# EAGLE design NanoBase_L293D (EAGLE 7.6.0)
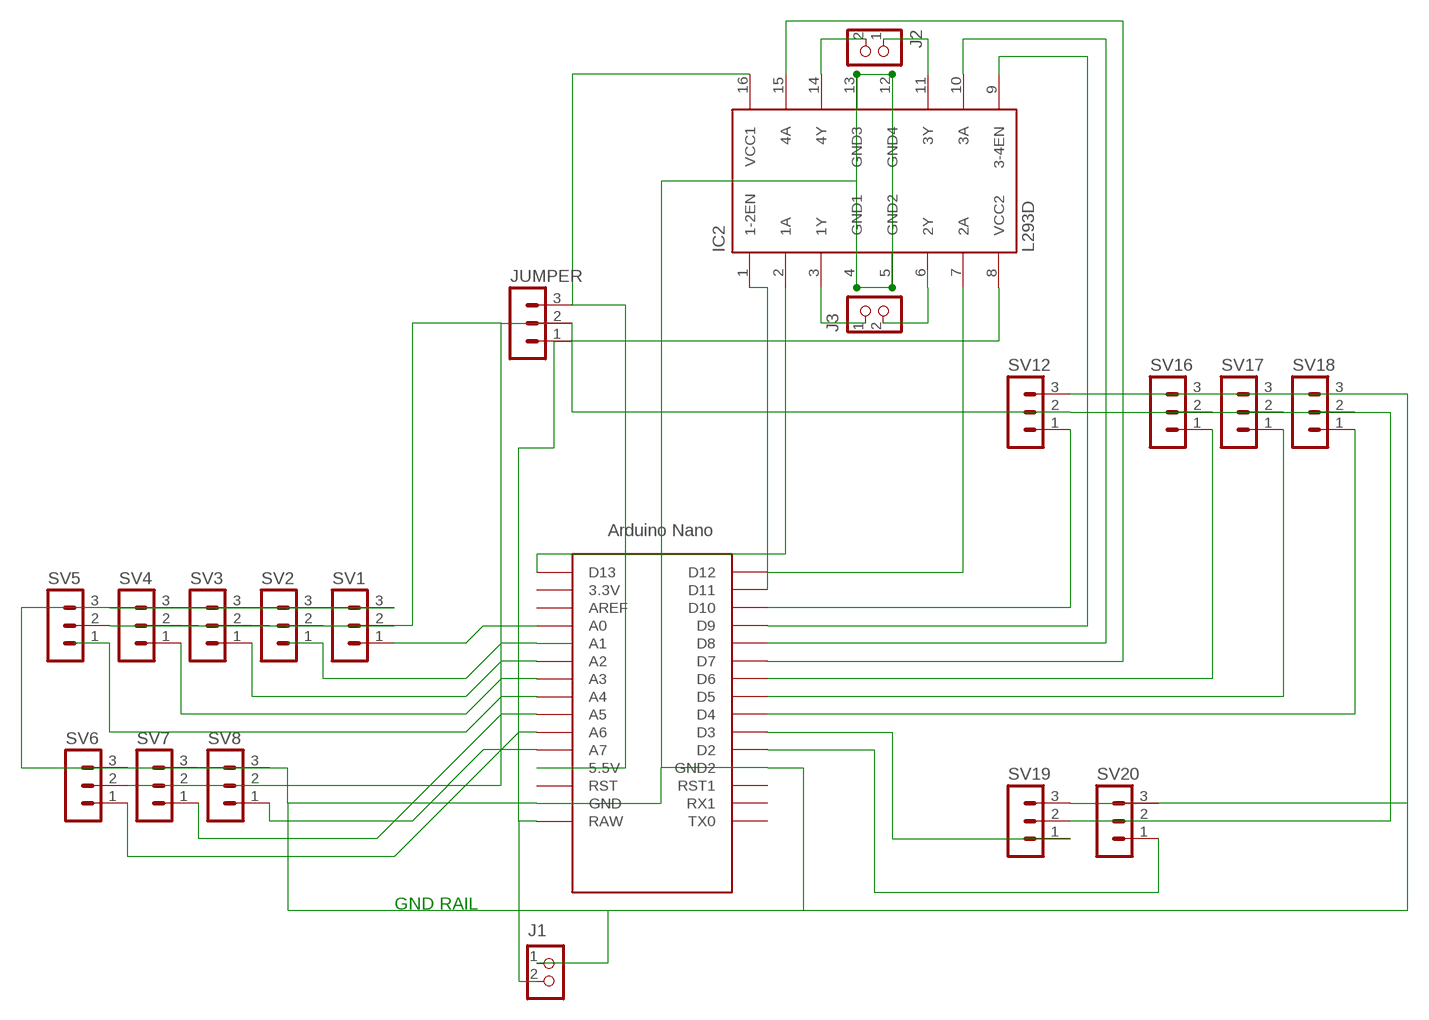
[diagram p0: schematic, sheet 1]

## Parts
IC2  L293D  [DIL16]
J1  CON_TERMINAL_BLOCK_02-5MM  [TERMINAL_BLOCK_2P_5]
J2  CON_TERMINAL_BLOCK_02-5MM  [TERMINAL_BLOCK_2P_5]
J3  CON_TERMINAL_BLOCK_02-5MM  [TERMINAL_BLOCK_2P_5]
JUMPER  MA03-1  [MA03-1]
SV1  MA03-1  [MA03-1]
SV2  MA03-1  [MA03-1]
SV3  MA03-1  [MA03-1]
SV4  MA03-1  [MA03-1]
SV5  MA03-1  [MA03-1]
SV6  MA03-1  [MA03-1]
SV7  MA03-1  [MA03-1]
SV8  MA03-1  [MA03-1]
SV12  MA03-1  [MA03-1]
SV16  MA03-1  [MA03-1]
SV17  MA03-1  [MA03-1]
SV18  MA03-1  [MA03-1]
SV19  MA03-1  [MA03-1]
SV20  MA03-1  [MA03-1]
U$1  NANO  [NANO]

## Nets
5V: IC2.16(VCC1) JUMPER.3 U$1.5V(5.5V)
A4: SV5.1 U$1.A4
A5: SV7.1 U$1.A5
D2: SV20.1 U$1.D2
D3: SV19.1 U$1.D3
D4: SV18.1 U$1.D4
D5: SV17.1 U$1.D5
D6: SV16.1 U$1.D6
D7-4A: IC2.15(4A) U$1.D7
D8-3A: IC2.10(3A) U$1.D8
D9-3-4EN: IC2.9(3-4EN) U$1.D9
D10: SV12.1 U$1.D10
D11-1-2EN: IC2.1(1-2EN) U$1.D11
D12-2A: IC2.7(2A) U$1.D12
D13-1A: IC2.2(1A) U$1.D13
GND: IC2.4(GND1) IC2.5(GND2) IC2.12(GND4) IC2.13(GND3) J1.1 SV1.3 SV2.3 SV3.3 SV4.3 SV5.3 SV6.3 SV7.3 SV8.3 SV12.3 SV16.3 SV17.3 SV18.3 SV19.3 SV20.3 U$1.GND U$1.GND1(GND2)
MIDDLERAIL: JUMPER.2 SV1.2 SV2.2 SV3.2 SV4.2 SV5.2 SV6.2 SV7.2 SV8.2
N$1: SV1.1 U$1.A0
N$4: SV3.1 U$1.A2
N$5: SV4.1 U$1.A3
N$8: SV12.2 SV16.2 SV17.2 SV18.2 SV19.2 SV20.2
N$9: SV6.1 U$1.A6
N$10: SV8.1 U$1.A7
N$11: IC2.14(4Y) J2.2
N$12: IC2.11(3Y) J2.1
N$13: IC2.3(1Y) J3.1
N$14: IC2.6(2Y) J3.2
N$17: SV2.1 U$1.A1
VIN: IC2.8(VCC2) J1.2 JUMPER.1 U$1.RAW
Unconnected: U$1.3.3V U$1.AREF U$1.ICSP1 U$1.ICSP2 U$1.ICSP3 U$1.ICSP4 U$1.ICSP5 U$1.ICSP6 U$1.RST U$1.RST1 U$1.RX1 U$1.TX0

## Notes on the sheet
- GND RAIL

## Library data of the parts
IC2 = st-microelectronics:L293D: PUSH-PULL 4 CHANNEL DRIVER; MPN: L293D; OC_FARNELL: 9589619; OC_NEWARK: 56P8249
J1-J3 = dp_devices:CON_TERMINAL_BLOCK_02: 2 poles wire to board terminal block
JUMPER SV1-SV8 SV12 SV16-SV20 = con-lstb:MA03-1: PIN HEADER; OC_FARNELL: unknown; OC_NEWARK: unknown
U$1 = Arduino-clone:NANO: Arduino Nano

## Board
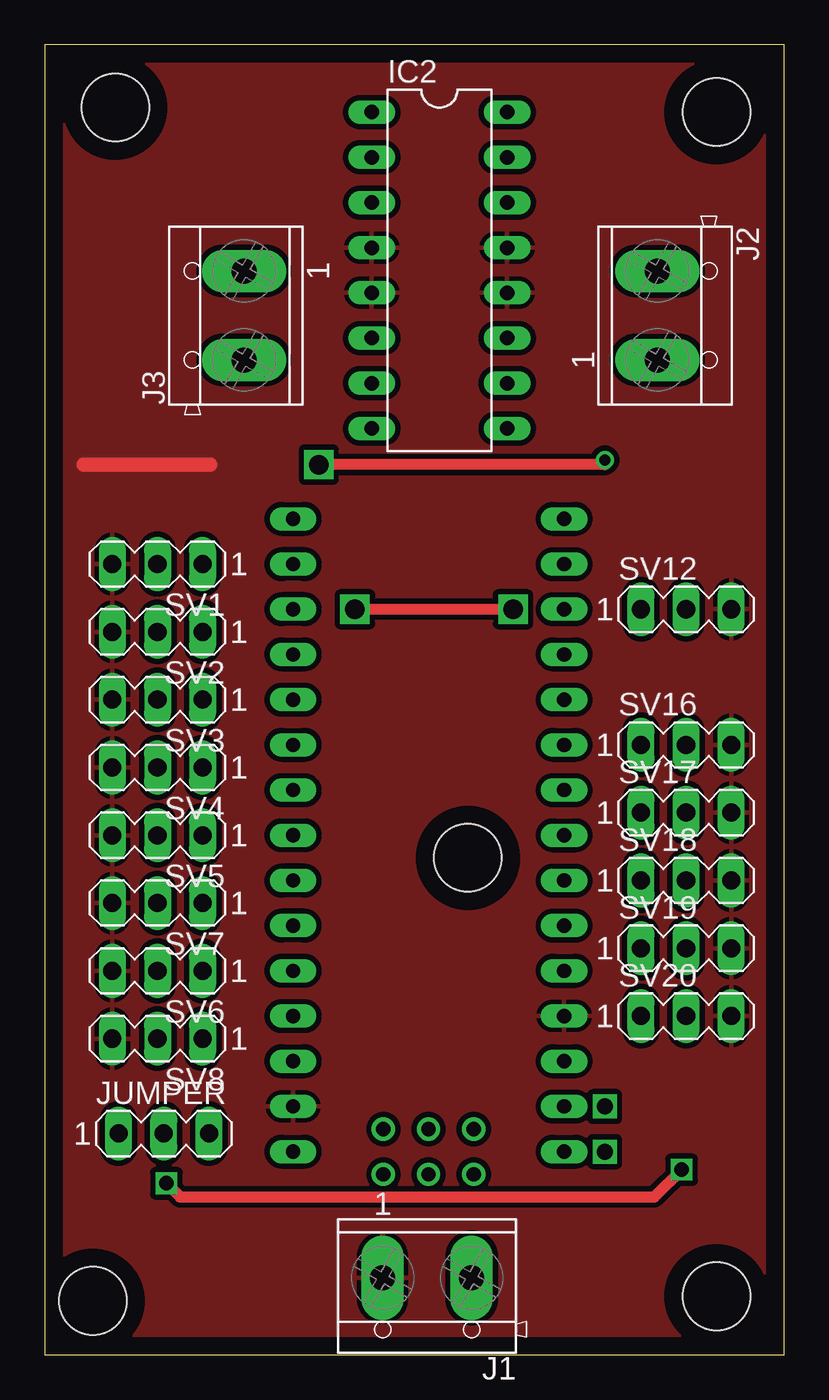
[diagram p1: board, top side]
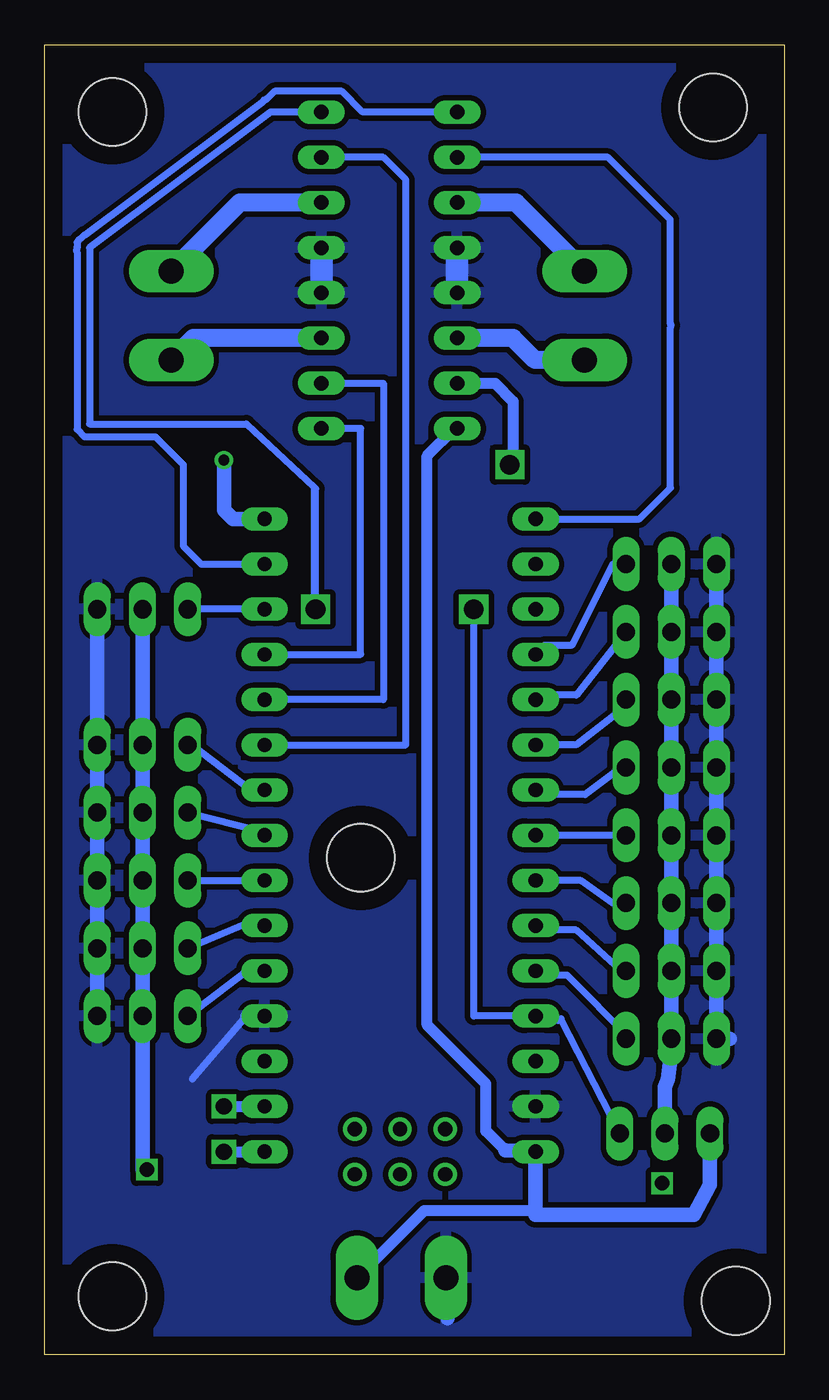
[diagram p2: board, bottom side, seen from below]

Size 41.58 x 73.65 mm. Coordinates in mm from the lower left corner, seen from the top.
Outline: 0,0 41.58,0 41.58,73.65 0,73.65 0,0
Copper layers (1*16): Top 0.035mm / dielectric 1.5mm / Bottom 0.035mm
Design rules "default *": minimum track width 10mil, minimum drill 24mil, track to track 12mil, track to pad 12mil, pad to pad 12mil, via to via 12mil, smd to smd 12mil, copper to edge 40mil, drill to drill 8mil, minimum pad ring 10mil, minimum via ring 8mil, stop-mask expansion 4mil, vias tented up to drill 0mil, thermal gap 10mil
Holes 3.81 mm at 2.72,3.05 3.99,70.1 37.77,69.85 37.77,3.3 23.8,27.94

### Footprints (pad centres in the part's own frame; a part is rotated, then mirrored left to right if it is on the bottom)
DIL16 = drill 0.813 long: 1 -8.89,-3.81; 2 -6.35,-3.81; 3 -3.81,-3.81; 4 -1.27,-3.81; 5 1.27,-3.81; 6 3.81,-3.81; 7 6.35,-3.81; 8 8.89,-3.81; 9 8.89,3.81; 10 6.35,3.81; 11 3.81,3.81; 12 1.27,3.81; 13 -1.27,3.81; 14 -3.81,3.81; 15 -6.35,3.81; 16 -8.89,3.81
TERMINAL_BLOCK_2P_5 = drill 1.4 pad 2.38 long: 1 2.5,-0.45; 2 -2.5,-0.45
MA03-1 = drill 1.016 long: 1 -2.54,0; 2 0,0; 3 2.54,0
NANO = drill 0.8 long: 3.3V -10.16,24.13; 5V -10.16,-1.27; A0 -10.16,19.05; A1 -10.16,16.51; A2 -10.16,13.97; A3 -10.16,11.43; A4 -10.16,8.89; A5 -10.16,6.35; A6 -10.16,3.81; A7 -10.16,1.27; AREF -10.16,21.59; D2 5.08,1.27; D3 5.08,3.81; D4 5.08,6.35; D5 5.08,8.89; D6 5.08,11.43; D7 5.08,13.97; D8 5.08,16.51; D9 5.08,19.05; D10 5.08,21.59; D11 5.08,24.13; D12 5.08,26.67; D13 -10.16,26.67; GND -10.16,-6.35; GND1 5.08,-1.27; RAW -10.16,-8.89; RST -10.16,-3.81; RST1 5.08,-3.81; RX1 5.08,-6.35; TX0 5.08,-8.89 | drill 0.8: ICSP1 -5.08,-10.16; ICSP2 -5.08,-7.62; ICSP3 -2.54,-10.16; ICSP4 -2.54,-7.62; ICSP5 0,-10.16; ICSP6 0,-7.62

### Placement (x,y rotation side)
IC2  22.2,60.96 270 top
J1  21.51,3.89 180 top
J2  34.9,58.42 270 top
J3  10.77,58.42 90 top
JUMPER  6.71,12.45 0 top
SV1  6.35,44.45 180 top
SV2  6.35,40.64 180 top
SV3  6.35,36.83 180 top
SV4  6.35,33.02 180 top
SV5  6.35,29.21 180 top
SV6  6.35,21.59 180 top
SV7  6.35,25.4 180 top
SV8  6.35,17.78 180 top
SV12  36.07,41.91 0 top
SV16  36.07,34.29 0 top
SV17  36.07,30.48 0 top
SV18  36.07,26.67 0 top
SV19  36.07,22.86 0 top
SV20  36.07,19.05 0 top
U$1  24.13,20.32 0 top

### Tracks (layer width: path | path; a pad name or v marks a point on that pad's centre or on a via)
5V  (via drill 1.1)
  Top 0.61: v17.45,41.91 v26.34,41.91
  Bottom 0.406: IC2.16 28.88,69.85 39.04,62.23 39.04,52.32 30.23,52.32 26.42,48.77 | v17.45,41.91 17.45,19.05 U$1.5V 13.72,18.8 12.7,18.8 12.55,18.9 JUMPER.3 | v26.34,41.91 26.34,48.69 26.42,48.77 | 26.42,48.77 26.42,42.16 26.16,41.91 26.42,41.91
A4
  Bottom 0.406: SV5.1 U$1.A4
A5
  Bottom 0.406: SV7.1 9.65,25.4 11.43,26.67 U$1.A5
D2
  Bottom 0.406: SV20.1 30.23,21.59 U$1.D2
D3
  Bottom 0.406: SV19.1 30.48,24.13 29.46,23.88 U$1.D3
  Bottom 0.813: 28.88,24.13 U$1.D3
D4
  Bottom 0.406: SV18.1 U$1.D4
D5
  Bottom 0.406: 33.02,30.48 SV17.1 29.46,29.46 U$1.D5
D6
  Bottom 0.406: SV16.1 33.27,34.29 29.97,31.75 29.46,32 U$1.D6
D7-4A
  Bottom 0.406: U$1.D7 21.26,34.29 21.26,66.04 22.53,67.31 IC2.15
D8-3A
  Bottom 0.406: IC2.10 22.53,54.61 22.53,36.83 U$1.D8
D9-3-4EN
  Bottom 0.406: U$1.D9 23.8,39.37 23.8,52.07 IC2.9 26.34,52.07
D10
  Bottom 0.406: U$1.D10 SV12.1
D11-1-2EN
  Bottom 0.406: 18.72,69.85 IC2.1 23.7,69.85 24.86,71.02 28.65,71.02 29.07,70.6 29.12,70.56 29.17,70.56 29.35,70.39 36.39,65.11 39.28,62.94 39.33,62.94 39.51,62.77 39.7,62.62 39.71,62.57 39.75,62.52 39.75,62.28 39.79,62.04 39.75,61.99 39.75,52.03 39.33,51.61 35.36,51.61 33.78,50.04 33.78,45.47 32.77,44.45 U$1.D11
D12-2A  (via drill 0.61, 1.1)
  Top 0.61: v31.5,50.29 31.5,50.04 v15.42,50.04
  Bottom 0.406: U$1.D12 28.88,46.99
  Bottom 0.61: IC2.7 16.26,54.61 15.24,53.59 15.24,50.22 v15.42,50.04
  Bottom 0.813: v31.5,50.29 31.5,47.5 30.99,46.99 U$1.D12
D13-1A
  Bottom 0.406: 13.45,46.99 U$1.D13 8.13,46.99 6.39,48.73 6.39,57.76 6.34,57.86 6.4,58.03 6.4,63.8 9.91,67.31 IC2.2
GND
  Top 0.813: 9.32,50.04 2.21,50.04
  Bottom 0.406: IC2.5 18.29,59.69 | 30.15,19.05 30.23,19.05 33.27,15.49
  Bottom 0.813: SV12.3 SV16.3 SV17.3 SV18.3 SV19.3 SV20.3 | 30.15,19.05 U$1.GND1 | SV1.3 SV2.3 SV3.3 SV4.3 SV5.3 SV7.3 SV6.3 SV8.3 3.05,17.78 | J1.1 18.99,3.81 | 18.99,3.81 18.93,2.07 | 18.29,5.08 18.48,4.57 18.99,3.81
  Bottom 1.27: IC2.12 IC2.13 | IC2.5 IC2.4
  pour Top: -3.3,74.42 43.69,74.42 43.69,-2.03 -3.3,-2.03
  pour Bottom: -4.83,78.23 43.94,78.23 45.97,76.2 45.97,-1.27 43.43,-3.81 -3.81,-3.81 -5.33,-2.29 -5.33,77.72
MIDDLERAIL
  Bottom 0.813: SV1.2 SV2.2 SV3.2 SV4.2 SV5.2 SV7.2 SV6.2 SV8.2 6.27,17.45 6.53,15.49 6.71,15.06 JUMPER.2
N$1
  Bottom 0.406: 8.56,44.45 9.65,44.45 11.94,39.88 13.46,39.88 U$1.A0
  Bottom 0.813: SV1.1 8.56,44.45
N$2  (via drill 0.9)
  other vias: 31.5,13.97
N$4
  Bottom 0.406: SV3.1 8.38,36.83 11.68,34.29 U$1.A2
N$5
  Bottom 0.406: SV4.1 9.14,33.02 11.18,31.5 13.72,31.5 U$1.A3
N$6  (via drill 0.9)
  other vias: 31.5,11.43
N$7
  Bottom 0.61: 30.99,13.97 30.23,13.97
N$8
  Bottom 0.813: SV12.2 SV16.2 SV17.2 SV18.2 SV19.2 SV20.2
N$9
  Bottom 0.406: SV6.1 9.14,21.59 11.68,23.88 13.72,23.88 U$1.A6
N$10
  Bottom 0.406: SV8.1 8.64,17.78 12.19,21.34 13.72,21.34 U$1.A7
N$11
  Bottom 1.016: IC2.14 30.6,64.77 J2.2
N$12
  Bottom 1.016: IC2.11 33.22,57.15 J2.1
N$13
  Bottom 0.406: 11.1,61.04 J3.1
  Bottom 1.016: J3.1 15.07,64.77 IC2.3
N$14
  Bottom 1.016: J3.2 14.01,55.92 15.24,57.15 IC2.6
N$16  (via drill 0.81)
  Top 0.406: 7.11,9.4 v6.86,9.65
  Top 0.61: v6.86,9.65 7.62,8.89 34.29,8.89 v35.81,10.41
  Bottom 0.813: 36.07,18.54 36.07,10.41 v35.81,10.41
N$17
  Bottom 0.406: SV2.1 11.68,37.08 13.72,37.08 U$1.A1
N$18
  Bottom 0.61: 31.24,11.43 30.23,11.43
VIN
  Bottom 0.406: 18.54,52.07 IC2.8
  Bottom 0.61: J1.2 20.22,8.13 14.22,8.13 13.97,7.87 | 15.67,11.5 16.76,12.59 16.76,15.24 20.07,18.54 20.07,50.55 18.54,52.07
  Bottom 0.813: JUMPER.1 4.17,9.55 5.08,7.87 13.97,7.87 U$1.RAW 15.67,11.5